# EAGLE schematic Schematic (EAGLE 6.5.0)
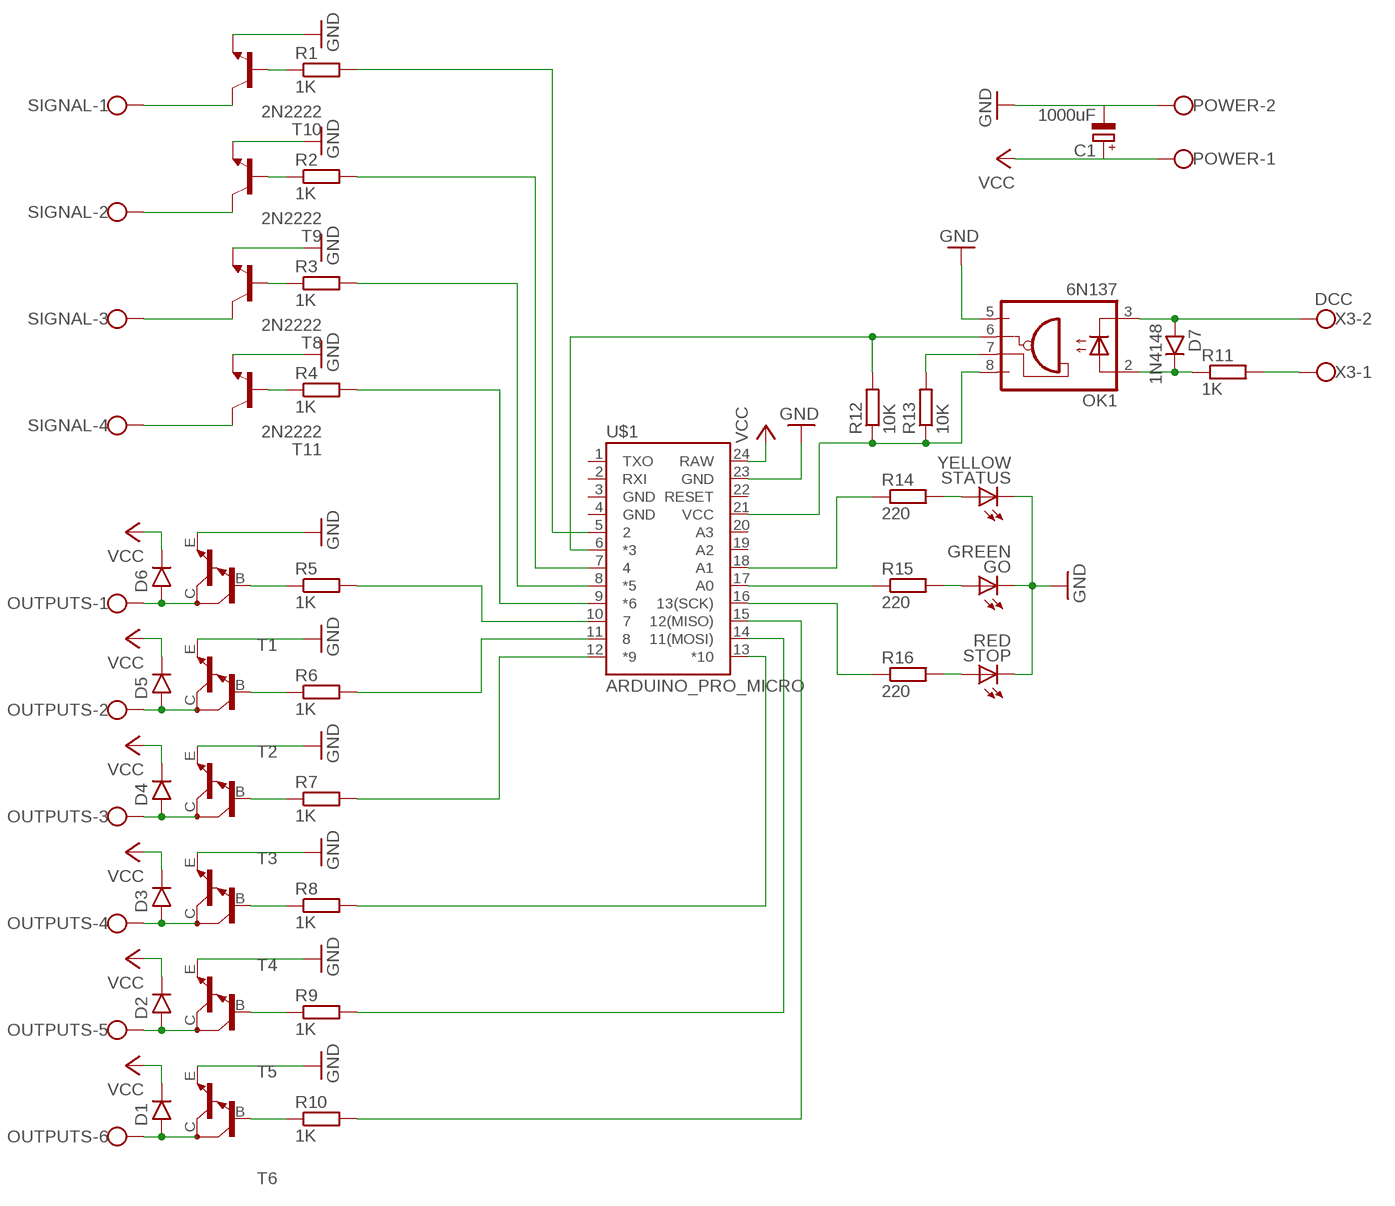
[diagram p0: schematic, sheet 1]

## Parts
C1  1000uF  CPOL-EUE5-13  [E5-13]
D1  DO41.3  [DO41-3]
D2  DO41.3  [DO41-3]
D3  DO41.3  [DO41-3]
D4  DO41.3  [DO41-3]
D5  DO41.3  [DO41-3]
D6  DO41.3  [DO41-3]
D7  1N4148  1N914.3  [DO35-3]
GO  GREEN  LED3MM  [LED3MM]
OK1  6N137  [DIL08]
OUTPUTS  W237-6  [W237-6]
POWER  W237-102  [W237-102]
R1  1K  R-EU_0204/7  [0204/7]
R2  1K  R-EU_0204/7  [0204/7]
R3  1K  R-EU_0204/7  [0204/7]
R4  1K  R-EU_0204/7  [0204/7]
R5  1K  R-EU_0204/7  [0204/7]
R6  1K  R-EU_0204/7  [0204/7]
R7  1K  R-EU_0204/7  [0204/7]
R8  1K  R-EU_0204/7  [0204/7]
R9  1K  R-EU_0204/7  [0204/7]
R10  1K  R-EU_0204/7  [0204/7]
R11  1K  R-EU_0204/7  [0204/7]
R12  10K  R-EU_0204/7  [0204/7]
R13  10K  R-EU_0204/7  [0204/7]
R14  220  R-EU_0204/7  [0204/7]
R15  220  R-EU_0204/7  [0204/7]
R16  220  R-EU_0204/7  [0204/7]
SIGNAL  W237-4  [W237-4]
STATUS  YELLOW  LED3MM  [LED3MM]
STOP  RED  LED3MM  [LED3MM]
T1  TIP122VERTICAL  [TO220AV]
T2  TIP122VERTICAL  [TO220AV]
T3  TIP122VERTICAL  [TO220AV]
T4  TIP122VERTICAL  [TO220AV]
T5  TIP122VERTICAL  [TO220AV]
T6  TIP122VERTICAL  [TO220AV]
T8  2N2222  -NPN-TO92-EBC  [TO92-EBC]
T9  2N2222  -NPN-TO92-EBC  [TO92-EBC]
T10  2N2222  -NPN-TO92-EBC  [TO92-EBC]
T11  2N2222  -NPN-TO92-EBC  [TO92-EBC]
U$1  ARDUINO_PRO_MICRO  [ARDUINO_PRO_MICRO]
X3  DCC  W237-102  [W237-102]

## Nets
GND: C1.- GO.K(C) OK1.5(GND) POWER.2 STATUS.K(C) STOP.K(C) T1.E T2.E T3.E T4.E T5.E T6.E T8.E T9.E T10.E T11.E U$1.23(GND)
N$1: R4.1 T11.B
N$2: R3.1 T8.B
N$3: R2.1 T9.B
N$4: R1.1 T10.B
N$5: SIGNAL.1 T10.C
N$6: SIGNAL.2 T9.C
N$7: SIGNAL.3 T8.C
N$8: SIGNAL.4 T11.C
N$9: D1.A OUTPUTS.6 T6.C
N$10: D2.A OUTPUTS.5 T5.C
N$11: D3.A OUTPUTS.4 T4.C
N$12: D4.A OUTPUTS.3 T3.C
N$13: D5.A OUTPUTS.2 T2.C
N$14: D6.A OUTPUTS.1 T1.C
N$15: R5.1 T1.B
N$16: R6.1 T2.B
N$17: R7.1 T3.B
N$18: R8.1 T4.B
N$19: R9.1 T5.B
N$20: R10.1 T6.B
N$21: OK1.6(VO) R12.2 U$1.6(*3)
N$22: R1.2 U$1.5
N$23: R2.2 U$1.7
N$24: R3.2 U$1.8(*5)
N$25: R4.2 U$1.9(*6)
N$26: R5.2 U$1.10
N$27: R6.2 U$1.11
N$28: R7.2 U$1.12(*9)
N$29: R8.2 U$1.13(*10)
N$30: R9.2 U$1.14(11(MOSI))
N$31: R10.2 U$1.15(12(MISO))
N$32: D7.C OK1.2(A) R11.1
N$33: D7.A OK1.3(C) X3.2
N$34: R11.2 X3.1
N$35: OK1.7(VE) R13.2
N$36: OK1.8(VCC) R12.1 R13.1 U$1.21(VCC)
N$37: R14.2 STATUS.A
N$38: GO.A R15.2
N$39: R16.2 STOP.A
N$41: R16.1 U$1.16(13(SCK))
N$42: R15.1 U$1.17(A0)
N$43: R14.1 U$1.18(A1)
VCC: C1.+ D1.C D2.C D3.C D4.C D5.C D6.C POWER.1 U$1.24(RAW)
Unconnected: U$1.1(TXO) U$1.2(RXI) U$1.3(GND) U$1.4(GND) U$1.19(A2) U$1.20(A3) U$1.22(RESET)

## Library data of the parts
C1 = rcl:CPOL-EU: POLARIZED CAPACITOR, European symbol
D1-D6 = gm-diodes:DO41: DO-41 Package Diodes: 1N4001 - 1N40019 Zener Diodes: 1N4728 - 1N4764
D7 = gm-diodes:1N914: Fast Switching Diode DO-35 glass case a.k.a. 1N4148
GO STATUS STOP = SparkFun-LED:LED: LEDs Standard schematic elements and footprints for 5mm, 3mm, 1206, and 0603 sized LEDs. 5mm - Spark Fun Electronics SKU : COM-00529 (and others)
OK1 = optocoupler:6N137: MOTOROLA OPTO COUPLER; MPN: 6N137; OC_FARNELL: 1328376; OC_NEWARK: 52M1895
OUTPUTS = con-wago-500:W237-6: WAGO SCREW CLAMP; OC_FARNELL: unknown; OC_NEWARK: unknown
POWER X3 = con-wago-500:W237-102: WAGO SCREW CLAMP; MPN: 237-102; OC_FARNELL: unknown; OC_NEWARK: 70K9898
R1-R10 R14-R16 = rcl:R-EU_: RESISTOR, European symbol
R11-R13 = resistor:R-EU_: RESISTOR, European symbol
SIGNAL = con-wago-500:W237-4: WAGO SCREW CLAMP; OC_FARNELL: unknown; OC_NEWARK: unknown
T1-T6 = transistor:TIP122: NPN BIPOLAR DARLINGTON TRANSISTOR
T8-T11 = transistor-neu-to92:*-NPN-: NPN Transistror
U$1 = SparkFun-Boards:ARDUINO_PRO_MICRO